# Altium schematic sheet 网表.SchDoc
size A4; SheetNumber: 8; SheetTotal: 8
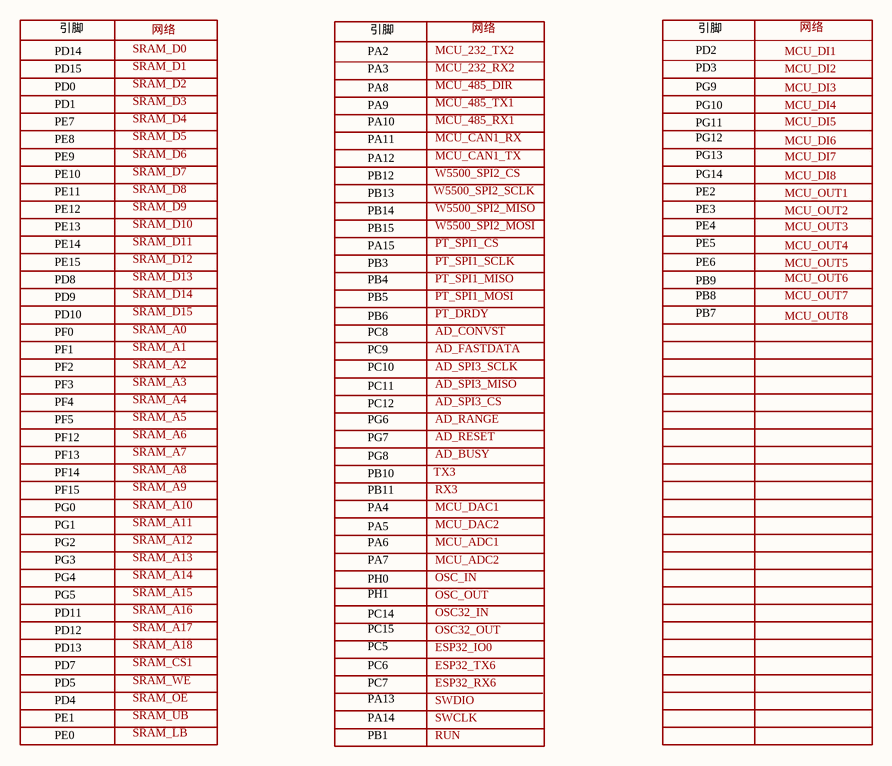
[diagram p0: 网表.SchDoc]

## Notes on the sheet
- 引脚
- 网络
- PD14
- PD15
- PD0
- PD1
- SRAM_D0
- SRAM_D1
- SRAM_D2
- SRAM_D3
- PA2
- PA3
- PA8
- PA9
- MCU_232_TX2
- MCU_232_RX2
- MCU_485_DIR
- MCU_485_TX1
- PD2
- PD3
- PG9
- PG10
- MCU_DI1
- MCU_DI2
- MCU_DI3
- MCU_DI4
- PE7
- PE8
- PE9
- PE10
- SRAM_D4
- SRAM_D5
- SRAM_D6
- SRAM_D7
- PA10
- PA11
- PA12
- PB12
- MCU_485_RX1
- MCU_CAN1_RX
- MCU_CAN1_TX
- W5500_SPI2_CS
- PG11
- PG12
- PG13
- PG14
- MCU_DI5
- MCU_DI6
- MCU_DI7
- MCU_DI8
- PE11
- PE12
- PE13
- PE14
- SRAM_D8
- SRAM_D9
- SRAM_D10
- SRAM_D11
- PB13
- PB14
- PB15
- PA15
- W5500_SPI2_SCLK
- W5500_SPI2_MISO
- W5500_SPI2_MOSI
- PT_SPI1_CS
- PE2
- PE3
- PE4
- PE5
- MCU_OUT1
- MCU_OUT2
- MCU_OUT3
- MCU_OUT4
- PE15
- PD8
- PD9
- PD10
- SRAM_D12
- SRAM_D13
- SRAM_D14
- SRAM_D15
- PB3
- PB4
- PB5
- PT_SPI1_SCLK
- PT_SPI1_MISO
- PT_SPI1_MOSI
- PT_DRDY
- PE6
- PB9
- PB8
- PB7
- MCU_OUT5
- MCU_OUT6
- MCU_OUT7
- PF0
- PF1
- PF2
- SRAM_A0
- SRAM_A1
- SRAM_A2
- PB6
- PC8
- PC9
- PC10
- AD_SPI3_SCLK
- AD_CONVST
- AD_FASTDATA
- MCU_OUT8
- PF3
- PF4
- PF5
- PF12
- SRAM_A3
- SRAM_A4
- SRAM_A5
- SRAM_A6
- PC11
- PC12
- PG6
- PG7
- AD_SPI3_MISO
- AD_SPI3_CS
- AD_RANGE
- AD_RESET
- PG0
- PF13
- PF14
- PF15
- SRAM_A7
- SRAM_A8
- SRAM_A9
- SRAM_A10
- PG8
- PB10
- PB11
- PA4
- TX3
- AD_BUSY
- RX3
- MCU_DAC1
- PG1
- PG2
- PG3
- PG4
- SRAM_A11
- SRAM_A12
- SRAM_A13
- SRAM_A14
- PA5
- PA6
- PA7
- PH0
- MCU_DAC2
- MCU_ADC1
- MCU_ADC2
- OSC_IN
- PG5
- PD11
- PD12
- PD13
- SRAM_A15
- SRAM_A16
- SRAM_A17
- SRAM_A18
- PH1
- PC14
- PC15
- PC5
- OSC_OUT
- OSC32_IN
- OSC32_OUT
- ESP32_IO0
- PE1
- PD4
- PD5
- PD7
- SRAM_CS1
- SRAM_WE
- SRAM_OE
- SRAM_UB
- PC6
- PC7
- PA13
- PA14
- ESP32_TX6
- ESP32_RX6
- SWDIO
- SWCLK
- PE0
- SRAM_LB
- PB1
- RUN